# EAGLE design main (EAGLE 4.11)
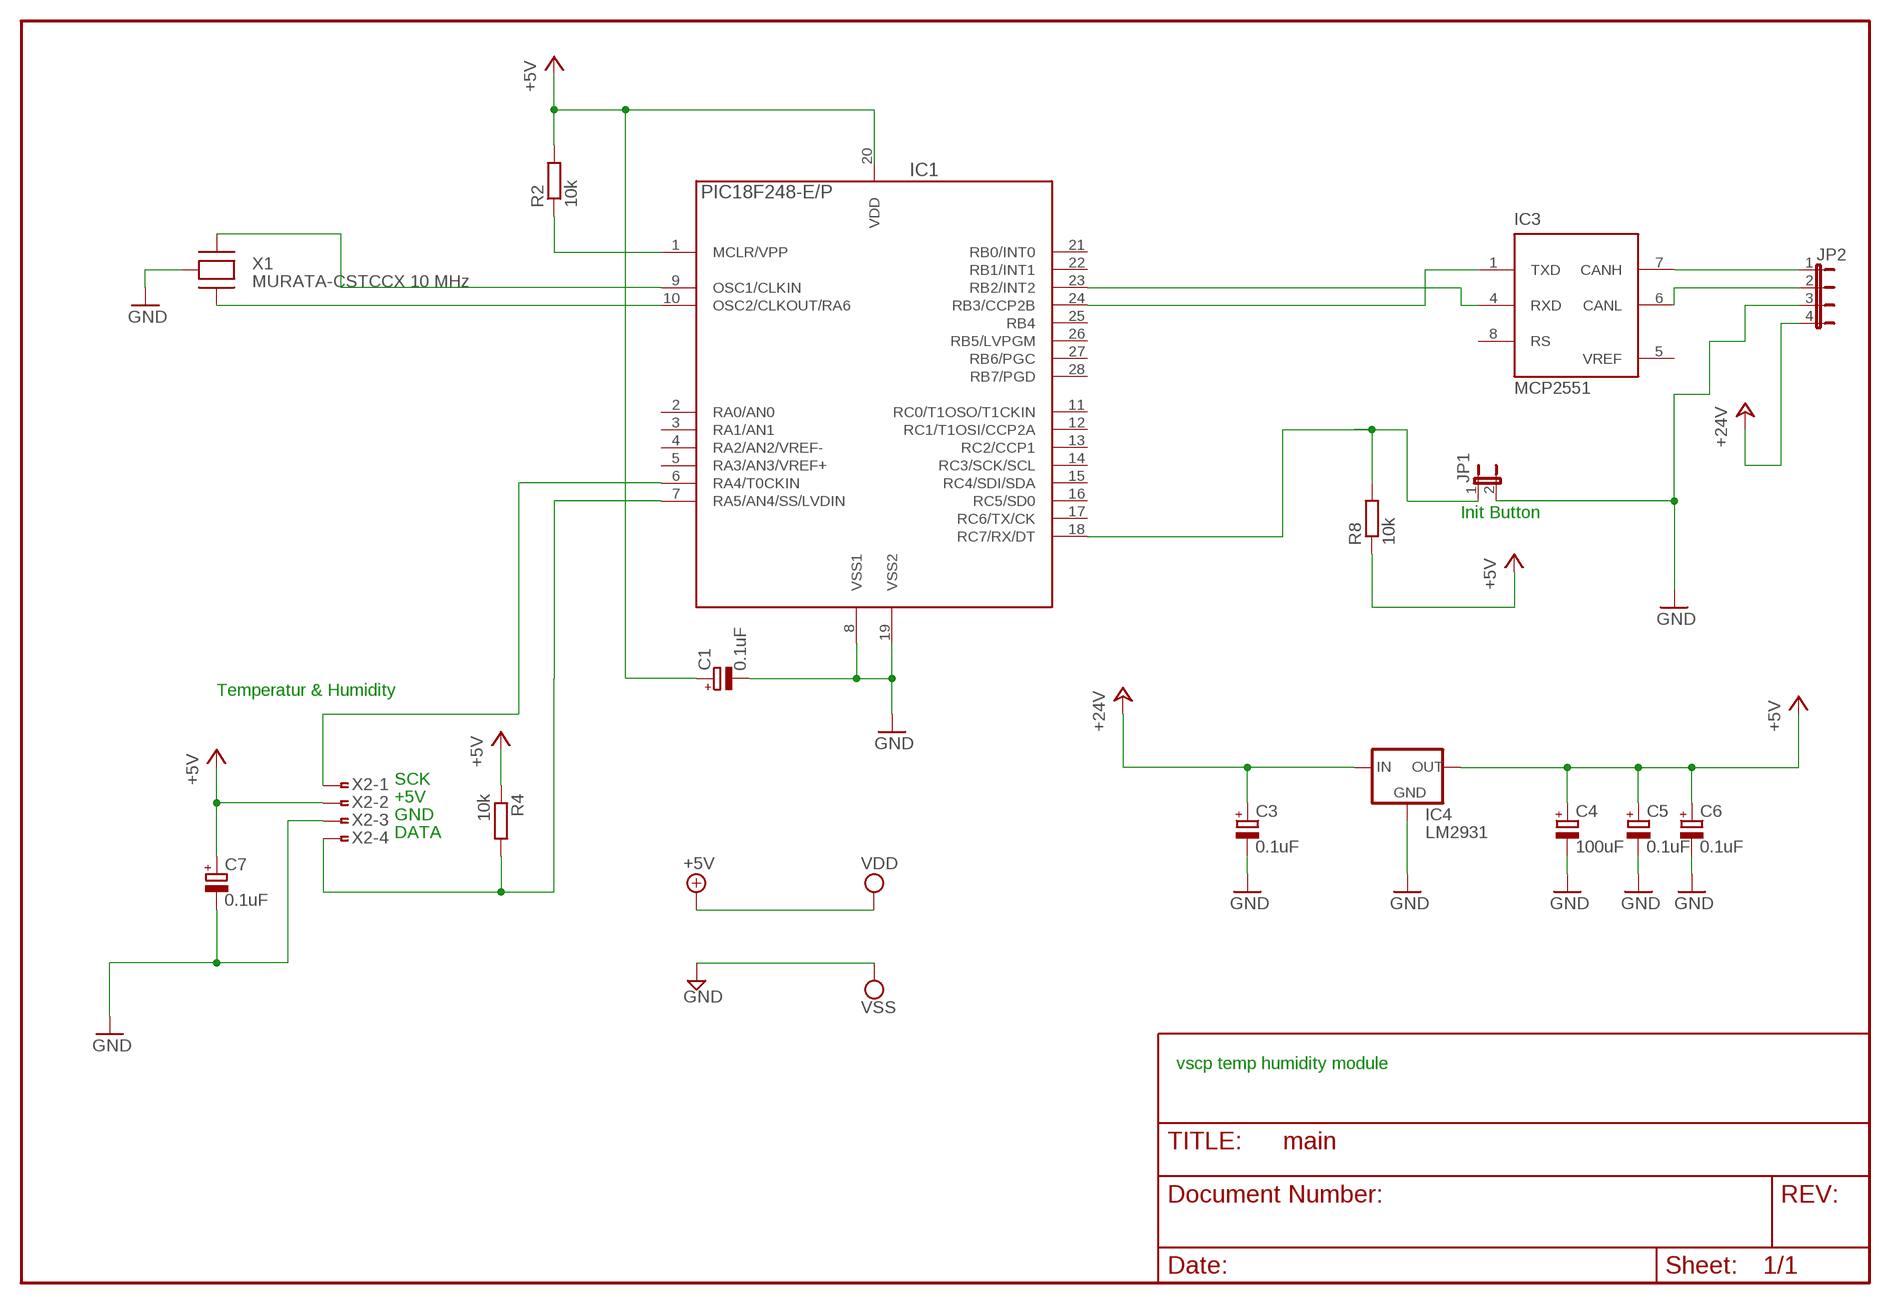
[diagram p0: schematic, sheet 1]

## Parts
C1  0.1uF  CPOL-EUCT3216  [CT3216]
C3  0.1uF  CPOL-EUCT3216  [CT3216]
C4  100uF  CPOL-EUCT7343  [CT7343]
C5  0.1uF  CPOL-EUCT3216  [CT3216]
C6  0.1uF  CPOL-EUCT3216  [CT3216]
C7  0.1uF  CPOL-EUCT3216  [CT3216]
IC1  PIC18F248-E/P  PIC18F252-E/P  [PDIP-28]
IC3  MCP2551  MCP2551SN  [SO-08]
IC4  LM2931  78LXX  [78LXX]
JP1  JP1E  [JP1]
JP2  JP4E  [JP4]
R2  10k  R-EU_R0805  [R0805]
R4  10k  R-EU_R0805  [R0805]
R8  10k  R-EU_R0805  [R0805]
X1  MURATA-CSTCCX 10 MHz  MURATA-CSTCCX  [RESONATOR-MURATA-CSTCCX]
X2  FTOP-4  [FTOP-4]

## Nets
+5V: C1.+ C4.+ C5.+ C6.+ C7.+ IC4.OUT R2.2 R4.1 R8.1 X2.2
+24V: C3.+ IC4.IN JP2.4
CANH: IC3.7(CANH) JP2.1
CANL: IC3.6(CANL) JP2.2
GND: C1.- C3.- C4.- C5.- C6.- C7.- IC1.8(VSS1) IC1.19(VSS2) IC4.GND JP1.2 JP2.3 X1.2(GND) X2.3
GP0: IC1.6(RA4/T0CKIN) X2.1
GP1: IC1.7(RA5/AN4/SS/LVDIN) R4.2 X2.4
N$1: IC1.10(OSC2/CLKOUT/RA6) X1.1(XTOUT)
N$2: IC1.9(OSC1/CLKIN) X1.3(XTIN)
N$3: R2.1
N$4: IC1.23(RB2/INT2) IC3.4(RXD)
RX0BF: IC1.18(RC7/RX/DT) JP1.1 R8.2
TXCAN: IC1.24(RB3/CCP2B) IC3.1(TXD)
Unconnected: IC1.1(MCLR/VPP) IC1.2(RA0/AN0) IC1.3(RA1/AN1) IC1.4(RA2/AN2/VREF-) IC1.5(RA3/AN3/VREF+) IC1.11(RC0/T1OSO/T1CKIN) IC1.12(RC1/T1OSI/CCP2A) IC1.13(RC2/CCP1) IC1.14(RC3/SCK/SCL) IC1.15(RC4/SDI/SDA) IC1.16(RC5/SD0) IC1.17(RC6/TX/CK) IC1.21(RB0/INT0) IC1.22(RB1/INT1) IC1.25(RB4) IC1.26(RB5/LVPGM) IC1.27(RB6/PGC) IC1.28(RB7/PGD) IC3.8(RS)

## Notes on the sheet
- Init Button
- Temperatur & Humidity
- SCK
- +5V
- GND
- DATA
- vscp temp humidity module

## Power pins joined to a net without a drawn wire
VDD: IC1.20(VDD) IC3.3(VDD)
VREF: IC3.5(VREF)
VSS: IC3.2(VSS)

## Library data of the parts
C1 C3-C7 = rcl:CPOL-EU: POLARIZED CAPACITOR, European symbol
IC1 = pic18:PIC18*F252-?: 18F252, 28 pin, 32Kb prog, 1536 data, 256 EEPROM
IC3 = microchip_can:MCP2551: High Speed CAN tranceiver
IC4 = v-reg:78LXX: VOLTAGE REGULATOR
JP1 = jumper:JP1E: JUMPER
JP2 = jumper:JP4E: JUMPER
R2 R4 R8 = rcl:R-EU_: RESISTOR, European symbol
X1 = eurosource_ftdi:MURATA-CSTCCX
X2 = con-amp:FTOP-4: AMP connector

## Board
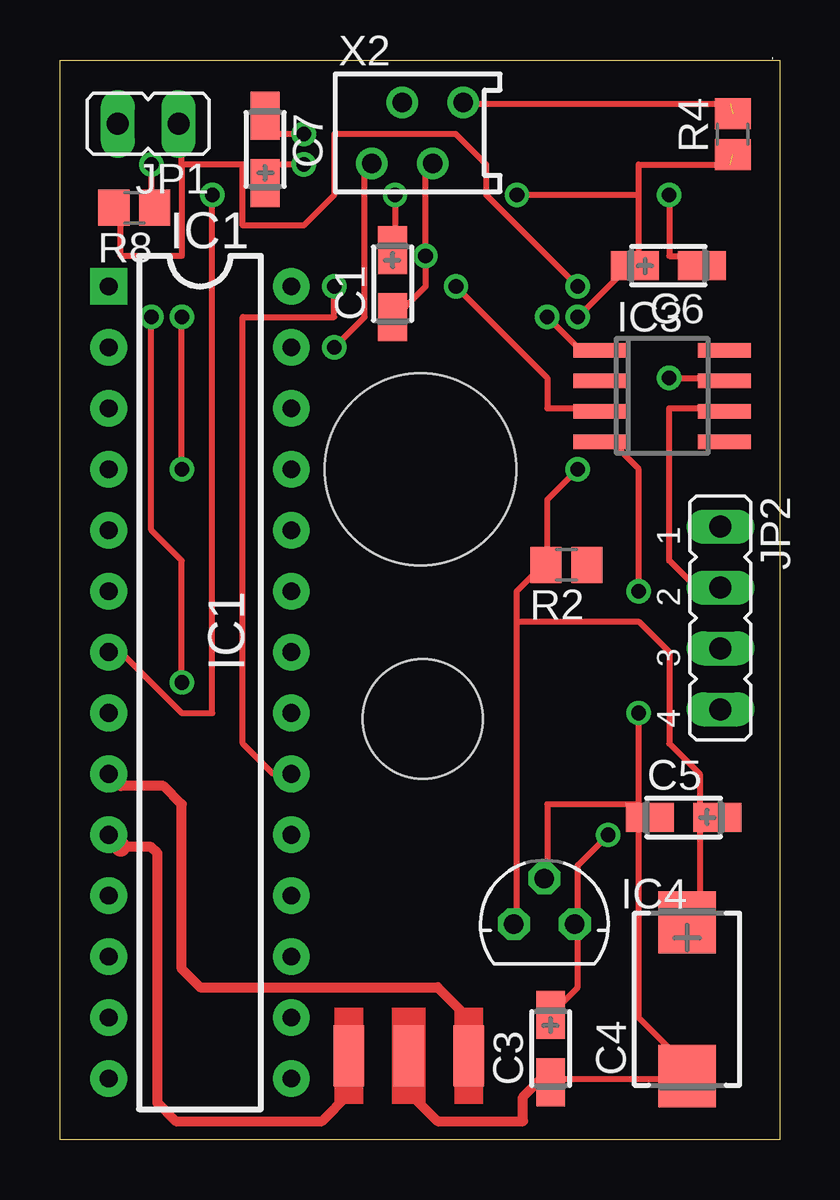
[diagram p1: board, top side]
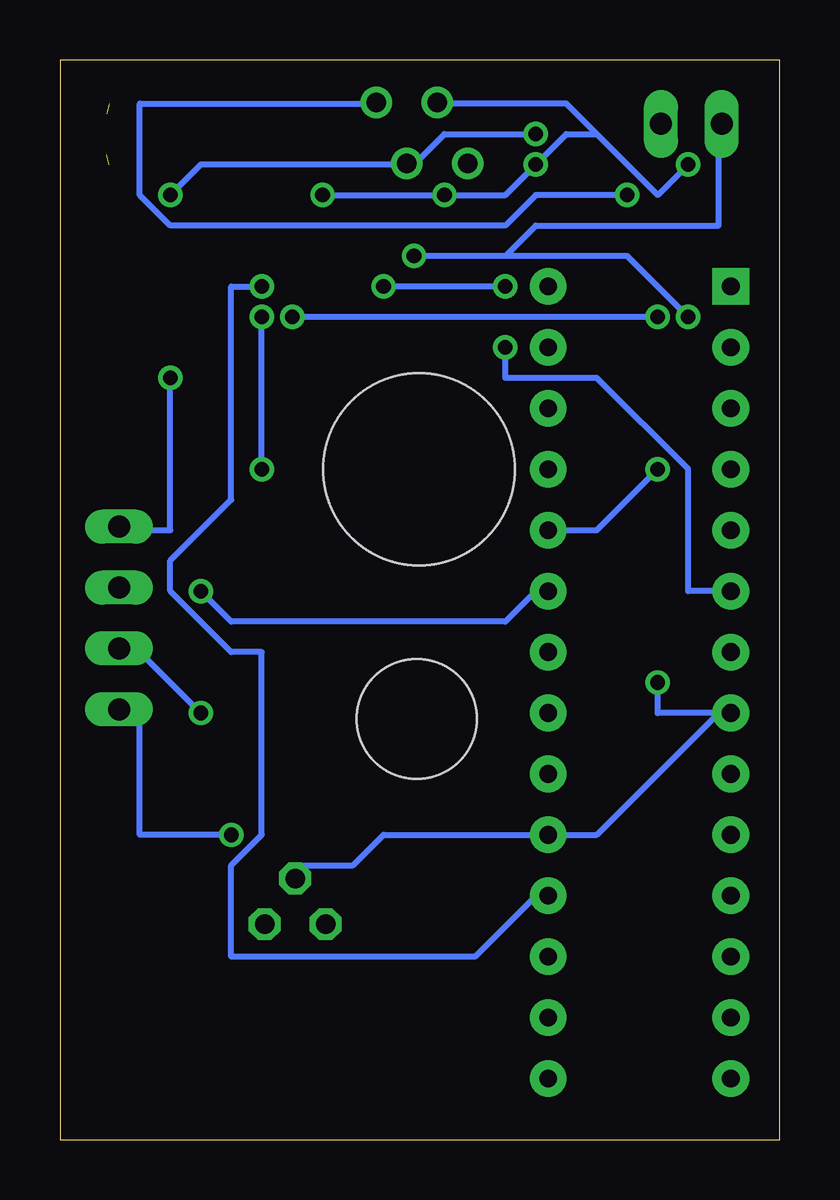
[diagram p2: board, bottom side, seen from below]

Size 30 x 45 mm. Coordinates in mm from the lower left corner, seen from the top.
Copper layers (1*16): Top 0.0254mm / dielectric 1.4986mm / Bottom 0.0254mm
Design rules "10mils": minimum track width 10mil, minimum drill 24mil, track to track 10mil, track to pad 10mil, pad to pad 10mil, via to via 10mil, smd to smd 10mil, copper to edge 40mil, drill to drill 10mil, minimum pad ring 10mil, minimum via ring 8mil, stop-mask expansion 0mil, vias tented up to drill 0mil, thermal gap 10mil

### Footprints (pad centres in the part's own frame; a part is rotated, then mirrored left to right if it is on the bottom)
CT3216 = smd 2 x 1.2: + 1.4,0; - -1.4,0
CT7343 = smd 2.6 x 2.4: + 3.2,0; - -3.2,0
PDIP-28 = drill 0.737 pad 1.524 square: 1 -17.78,-3.81 | drill 0.737 pad 1.524 round: 2 -15.24,-3.81; 3 -12.7,-3.81; 4 -10.16,-3.81; 5 -7.62,-3.81; 6 -5.08,-3.81; 7 -2.54,-3.81; 8 0,-3.81; 9 2.54,-3.81; 10 5.08,-3.81; 11 7.62,-3.81; 12 10.16,-3.81; 13 12.7,-3.81; 14 15.24,-3.81; 15 15.24,3.81; 16 12.7,3.81; 17 10.16,3.81; 18 7.62,3.81; 19 5.08,3.81; 20 2.54,3.81; 21 0,3.81; 22 -2.54,3.81; 23 -5.08,3.81; 24 -7.62,3.81; 25 -10.16,3.81; 26 -12.7,3.81; 27 -15.24,3.81; 28 -17.78,3.81
SO-08 = smd 0.6 x 2.2: 1 -1.905,-2.6; 2 -0.635,-2.6; 3 0.635,-2.6; 4 1.905,-2.6; 5 1.905,2.6; 6 0.635,2.6; 7 -0.635,2.6; 8 -1.905,2.6
78LXX = drill 0.813 octagon: GND 0,1.905; IN 1.27,0; OUT -1.27,0
JP1 = drill 0.914 long: 1 0,-1.27; 2 0,1.27
JP4 = drill 0.914 long: 1 -3.81,0; 2 -1.27,0; 3 1.27,0; 4 3.81,0
R0805 = smd 1.3 x 1.5: 1 -0.85,0; 2 0.85,0
SMALL_VSCP = hole 5: 15.124,17.532 | hole 8: 15.032,27.937
RESONATOR-MURATA-CSTCCX = smd 2.54 x 1.27: 1 -0.005,2.405; 2 0,-0.1; 3 0,-2.6
FTOP-4 = drill 0.813 round: 1 -1.905,-1.27; 2 -0.635,1.27; 3 0.635,-1.27; 4 1.905,1.27

### Placement (x,y rotation side)
C1  13.87,35.67 90 top
C3  20.46,3.79 90 top
C4  26.15,5.85 90 top
C5  26,13.42 0 top
C6  25.36,36.42 180 top
C7  8.55,41.27 270 top
IC1  5.84,17.78 270 top
IC3  25.1,31 270 top
IC4  20.2,8.98 0 top
JP1  3.68,42.34 90 top
JP2  27.54,21.74 270 top
R2  21.11,23.95 180 top
R4  28.04,41.91 90 top
R8  3.1,38.84 180 top
U$2  [SMALL_VSCP]  0,0 0 top
X1  14.44,3.5 90 top
X2  14.91,41.96 0 top

### Tracks (layer width: path | path; a pad name or v marks a point on that pad's centre or on a via)
+5V  (via drill 0.61)  (1 unrouted)
  Top 0.254: 26.67,13.97 26.67,10.16 C4.+ | 20.32,24.13 19.05,22.86 19.05,21.59 | 19.05,21.59 19.05,8.89 IC4.OUT | 26.67,13.97 26.67,15.24 25.4,16.51 25.4,20.32 24.13,21.59 19.05,21.59 | 26.67,13.97 C5.+ | 27.94,40.64 24.13,40.64 24.13,39.37 | 24.13,36.83 24.13,39.37 | v3.81,40.64 3.81,39.37 R8.1 | v13.97,39.37 13.97,36.83 C1.+ | v10.16,40.64 8.89,40.64 C7.+ | 24.13,39.37 v19.05,39.37 | 20.32,24.13 20.32,26.67 v21.59,27.94 | v21.59,34.29 24.13,36.83 | 20.32,24.13 R2.2 | 24.13,36.83 C6.+
  Bottom 0.254: v3.81,40.64 5.08,39.37 7.62,41.91 | 7.62,41.91 8.89,43.18 13.97,43.18 X2.2 | 7.62,41.91 8.89,41.91 v10.16,40.64 11.43,39.37 v13.97,39.37 v19.05,39.37 | v21.59,27.94 v21.59,34.29
+24V  (via drill 0.61)
  Top 0.254: v22.86,12.7 21.59,11.43 21.59,8.89 | 21.59,8.89 21.59,6.35 20.32,5.08 C3.+ | 21.59,8.89 IC4.IN
  Bottom 0.254: v22.86,12.7 26.67,12.7 26.67,17.78 JP2.4
CANH  (via drill 0.61)
  Top 0.254: v25.4,31.75 26.67,31.75 IC3.7
  Bottom 0.254: v25.4,31.75 25.4,25.4 26.67,25.4 JP2.1
CANL
  Top 0.254: IC3.6 26.67,30.48 25.4,30.48 25.4,24.13 26.67,22.86 JP2.2
GND  (via drill 0.61)
  Top 0.254: C1.- 13.97,34.29 15.24,35.56 v15.24,36.83 15.24,40.64 X2.3 | v10.16,41.91 8.89,41.91 C7.- | v25.4,39.37 25.4,36.83 26.67,36.83 C6.- | v3.81,34.29 3.81,25.4 5.08,24.13 v5.08,19.05 | C3.- 20.32,2.54 25.4,2.54 C4.- 25.4,3.81 24.13,5.08 24.13,13.97 | 24.13,13.97 20.32,13.97 20.32,11.43 IC4.GND | 24.13,13.97 v24.13,17.78 | 24.13,13.97 C5.-
  Top 0.406: 14.54,1.72 X1.2 14.54,1.97 15.75,0.76 19.3,0.76 19.3,1.78 20.32,2.79 20.46,2.65 C3.-
  Bottom 0.254: v10.16,41.91 13.97,41.91 15.24,40.64 | v25.4,39.37 24.13,40.64 15.24,40.64 | X2.3 15.24,40.64 | 11.43,36.83 10.16,38.1 2.54,38.1 2.54,41.91 JP1.2 | 11.43,36.83 v15.24,36.83 | IC4.GND 20.32,11.43 17.78,11.43 16.51,12.7 IC1.19 7.62,12.7 2.54,17.78 | 11.43,36.83 6.35,36.83 v3.81,34.29 | v5.08,19.05 5.08,17.78 2.54,17.78 | 2.54,17.78 IC1.8 | v24.13,17.78 26.67,20.32 JP2.3
GP0  (via drill 0.61)
  Top 0.254: v11.43,33.02 12.7,34.29 12.7,40.64 X2.1
  Bottom 0.254: v11.43,33.02 11.43,31.75 7.62,31.75 3.81,27.94 3.81,22.86 IC1.6
GP1  (via drill 0.61)  (1 unrouted)
  Top 0.254: 27.94,43.18 16.51,43.18 X2.4 | v6.35,39.37 6.35,17.78 5.08,17.78 2.54,20.32 IC1.7
  Bottom 0.254: v6.35,39.37 10.16,39.37 11.43,38.1 25.4,38.1 26.67,39.37 26.67,43.18 16.51,43.18 X2.4
N$1
  Top 0.406: 12.04,1.88 10.92,0.76 4.83,0.76 4.06,1.52 4.06,11.94 3.81,12.19 2.54,12.19
  Top 0.813: 12.04,1.88 X1.1 | 1.78,12.95 IC1.10 2.54,12.19
N$2
  Top 0.406: X1.3 17.04,5.06 15.75,6.35 5.84,6.35 5.08,7.11 5.08,13.97 4.32,14.73 2.54,14.73 IC1.9
N$4  (via drill 0.61)
  Top 0.254: v24.13,22.86 24.13,27.94 22.86,29.21 IC3.4
  Bottom 0.254: v24.13,22.86 22.86,21.59 11.43,21.59 10.16,22.86 IC1.23
RX0BF  (via drill 0.61)
  Top 0.254: 5.08,40.64 5.08,41.91 JP1.1 | 5.08,40.64 5.08,36.83 2.54,36.83 2.54,38.1 R8.2 | v21.59,35.56 17.78,39.37 17.78,40.64 16.51,41.91 11.43,41.91 11.43,39.37 10.16,38.1 7.62,38.1 7.62,40.64 5.08,40.64
  Bottom 0.254: v21.59,35.56 22.86,35.56 22.86,26.67 25.4,24.13 25.4,22.86 22.86,20.32 21.59,20.32 21.59,12.7 22.86,11.43 22.86,7.62 12.7,7.62 10.16,10.16 IC1.18
TXCAN  (via drill 0.61)
  Top 0.254: v20.32,34.29 21.59,33.02 IC3.1 | v5.08,27.94 v5.08,34.29
  Bottom 0.254: v5.08,34.29 v20.32,34.29 | v5.08,27.94 7.62,25.4 IC1.24 10.16,25.4
VDD  (via drill 0.61)
  Top 0.254: v16.51,35.56 20.32,31.75 20.32,30.48 21.59,30.48 IC3.3 | v11.43,35.56 11.43,34.29 7.62,34.29 7.62,16.51 8.89,15.24 IC1.20 10.16,15.24
  Bottom 0.254: v11.43,35.56 v16.51,35.56